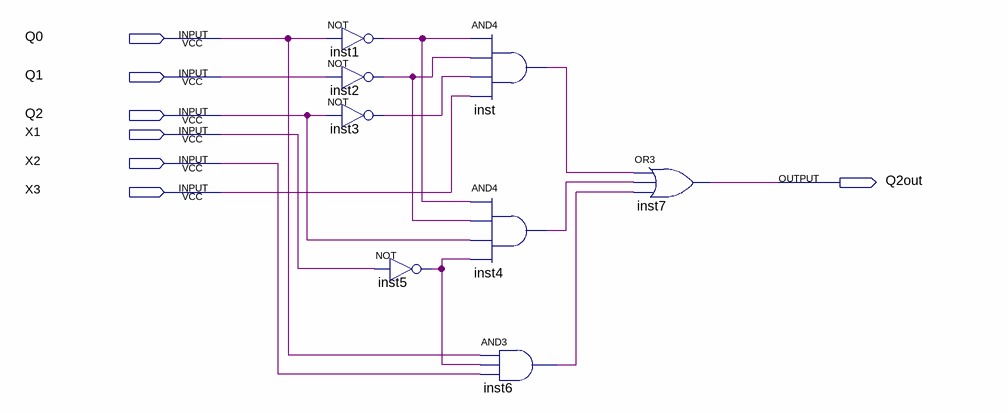
[diagram p0: schematic sheet]
// Quartus schematic P_q2.bdf as structural Verilog: 8 symbols, 7 pins
module P_q2 (
  input  Q0,
  input  Q1,
  input  Q2,
  input  X1,
  input  X2,
  input  X3,
  output Q2out
);

  wire inst1_out, inst2_out, inst3_out, inst4_out, inst5_out, inst6_out, inst_out;

  not inst1 (inst1_out, Q0);
  not inst2 (inst2_out, Q1);
  not inst3 (inst3_out, Q2);
  not inst5 (inst5_out, X1);
  and inst (inst_out, inst1_out, inst2_out, inst3_out, X3);
  and inst4 (inst4_out, inst1_out, inst2_out, Q2, inst5_out);
  and inst6 (inst6_out, Q0, inst5_out, X2);
  or inst7 (Q2out, inst_out, inst4_out, inst6_out);
endmodule
